# EAGLE schematic Power connector (EAGLE 9.6.2)
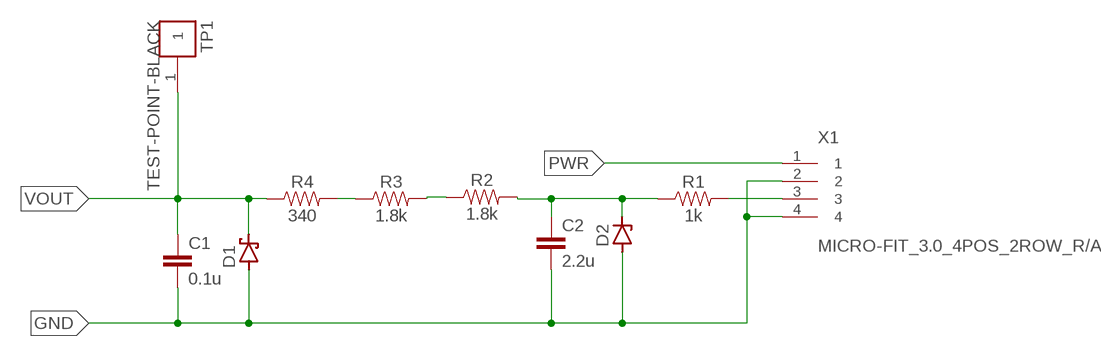
[diagram p0: schematic, sheet 1]

## Parts
C1  0.1u  CAP-0.1UF-0603-25V-X8R  [C0603]
C2  2.2u  CAP-2.2UF-10%-6.3V-X7R-0603IPC  [0603]
D1  SCHOTTKY-DIODESMD  [SMB]
D2  ZENER-DIODESOT23  [SOT23]
R1  1k  RES-1KOHM-0603-1/10W-1%  [R0603]
R2  1.8k  RES-1.8KOHM-0603-1/10W-.1%  [R0603]
R3  1.8k  RES-1.8KOHM-0603-1/10W-.1%  [R0603]
R4  340  RES-340OHM-0603-1/10W-1%  [R0603]
TP1  TEST-POINT-BLACK  [KEYSTONE_5001_0]
X1  MICRO-FIT_3.0_4POS_2ROW_R/A  [0430450400]

## Nets
GND: C1.2 C2.2 D1.A D2.1(A) X1.2 X1.4
N$2: R1.2 X1.3
N$3: C2.1 D2.3(C) R1.1 R2.2
N$4: R2.1 R3.2
N$5: R3.1 R4.2
PWR: X1.1
VOUT: C1.1 D1.C R4.1 TP1.1

## Library data of the parts
C1 = gtsr-passive:CAP-0.1UF: 0.1µF Ceramic Capacitor; MANUFACTURER: Murata Electronics; MFPN: GCM188R91E104KA37D; SUPPLIER: Digi-Key; SUPPLIER_PN: 490-14359-1-ND
C2 = gtsr-passive:CAP-2.2UF: 2.2µF Ceramic Capacitor; MFR: Murata Electronics; MPN: GCM188R70J225KE22D; SPN: 490-5316-1-ND; SPR: Digi-Key
D1 = diode:SCHOTTKY-DIODE: Schottky Diode
D2 = diode:ZENER-DIODE: Z-Diode
R1 = gtsr-passive:RES-1KOHM; MANUFACTURER: Panasonic; MFPN: ERJ-3EKF1001V; SUPPLIER: Digikey; SUPPLIER_PN: P1.00KHCT-ND
R2 R3 = gtsr-passive:RES-1.8KOHM; AUTOMOTIVE: Yes; MANUFACTURER: Panasonic; MFPN: ERA-3AEB182V; RESISTANCE: 1.8k; SUPPLIER: Digikey; SUPPLIER_PN: P1.8KDBCT-ND
R4 = gtsr-passive:RES-340OHM; MANUFACTURER: Panasonic; MFPN: ERJ-3EKF3400V; SUPPLIER: Digikey; SUPPLIER_PN: P340HCT-ND
TP1 = gtsr-connector:TEST-POINT: BLACK THRU-HOLE MOUNT TEST POINT; MANUFACTURER: Keystone Electronics; MFPN: 5001; SUPPLIER: Digikey; SUPPLIER_PN: 36-5001-ND
X1 = gtsr-connector:MICRO-FIT_3.0_4POS; MANUFACTURER: Molex; MFPN: 0430450400; SUPPLIER: Digi-Key; SUPPLIER_PN: WM1814-ND